# EAGLE design DSPIC33_Board_DIP_2020_09_23_A (EAGLE 9.6.1)
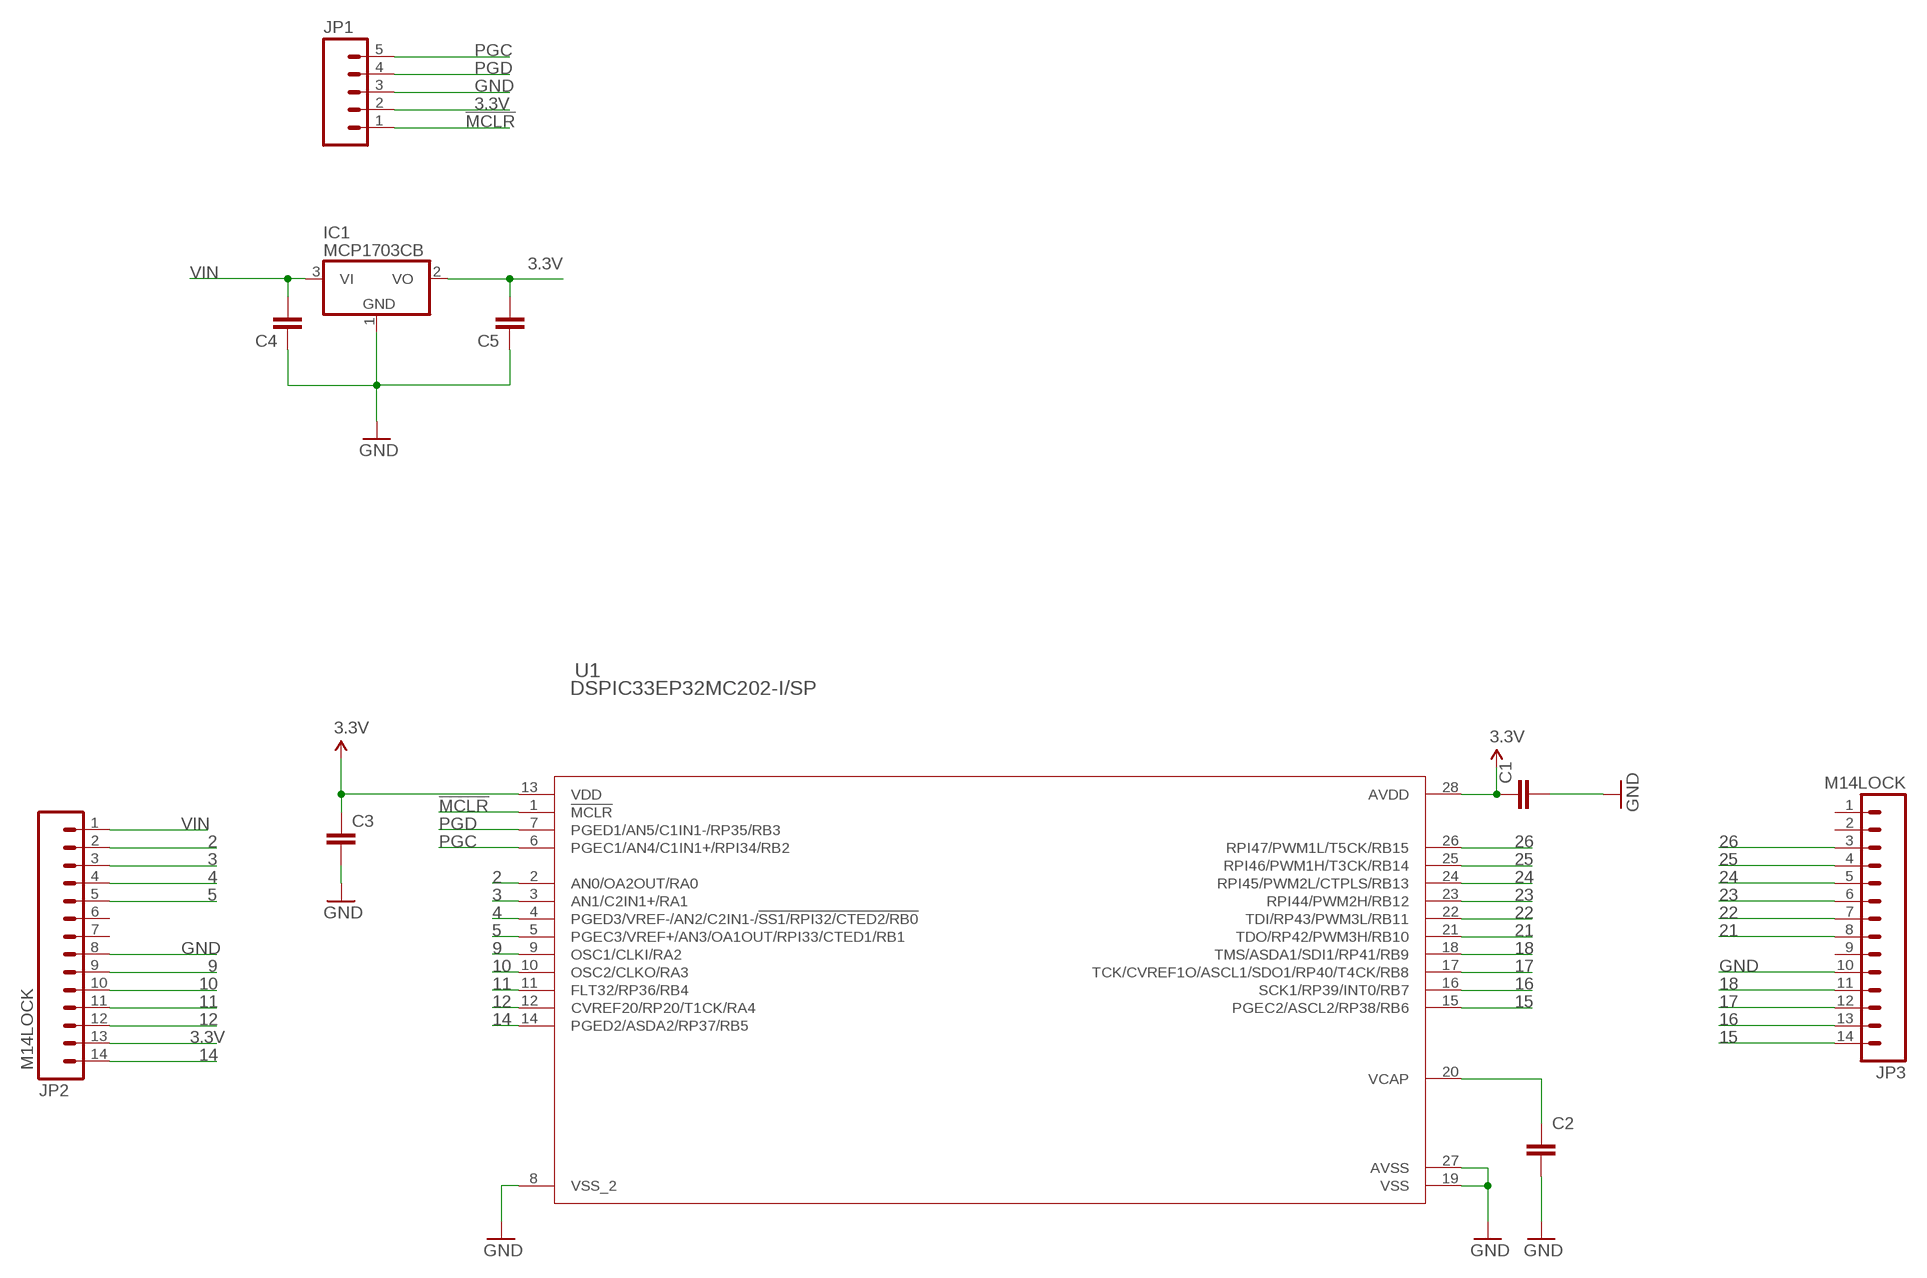
[diagram p0: schematic, sheet 1]

## Parts
C1  CAP1206  [1206]
C2  CAP1206  [1206]
C3  CAP1206  [1206]
C4  CAP1206  [1206]
C5  CAP1206  [1206]
IC1  MCP1703CB  [SOT23]
JP1  M05LOCK  [1X05_LOCK]
JP2  M14LOCK  [1X14_LOCK]
JP3  M14LOCK  [1X14_LOCK]
U1  DSPIC33EP32MC202-I/SP  [SPDIP28_300MC_MCH]

## Nets
2: JP2.2 U1.2(AN0/OA2OUT/RA0)
3: JP2.3 U1.3(AN1/C2IN1+/RA1)
3.3V: C1.1 C3.1 C5.2 IC1.2(VO) JP1.2 JP2.13 U1.13(VDD) U1.28(AVDD)
4: JP2.4 U1.4(PGED3/VREF-/AN2/C2IN1-/!SS1/RPI32/CTED2/RB0)
5: JP2.5 U1.5(PGEC3/VREF+/AN3/OA1OUT/RPI33/CTED1/RB1)
9: JP2.9 U1.9(OSC1/CLKI/RA2)
10: JP2.10 U1.10(OSC2/CLKO/RA3)
11: JP2.11 U1.11(FLT32/RP36/RB4)
12: JP2.12 U1.12(CVREF20/RP20/T1CK/RA4)
14: JP2.14 U1.14(PGED2/ASDA2/RP37/RB5)
15: JP3.14 U1.15(PGEC2/ASCL2/RP38/RB6)
16: JP3.13 U1.16(SCK1/RP39/INT0/RB7)
17: JP3.12 U1.17(TCK/CVREF1O/ASCL1/SDO1/RP40/T4CK/RB8)
18: JP3.11 U1.18(TMS/ASDA1/SDI1/RP41/RB9)
21: JP3.8 U1.21(TDO/RP42/PWM3H/RB10)
22: JP3.7 U1.22(TDI/RP43/PWM3L/RB11)
23: JP3.6 U1.23(RPI44/PWM2H/RB12)
24: JP3.5 U1.24(RPI45/PWM2L/CTPLS/RB13)
25: JP3.4 U1.25(RPI46/PWM1H/T3CK/RB14)
26: JP3.3 U1.26(RPI47/PWM1L/T5CK/RB15)
!MCLR: JP1.1 U1.1(!MCLR)
GND: C1.2 C2.1 C3.2 C4.1 C5.1 IC1.1(GND) JP1.3 JP2.8 JP3.10 U1.8(VSS_2) U1.19(VSS) U1.27(AVSS)
N$1: C2.2 U1.20(VCAP)
PGC: JP1.5 U1.6(PGEC1/AN4/C1IN1+/RPI34/RB2)
PGD: JP1.4 U1.7(PGED1/AN5/C1IN1-/RP35/RB3)
VIN: C4.2 IC1.3(VI) JP2.1
Unconnected: JP2.6 JP2.7 JP3.1 JP3.2 JP3.9

## Library data of the parts
C1-C5 = SparkFun-Passives:CAP: Capacitor Standard 0603 ceramic capacitor, and 0.1" leaded capacitor.
IC1 = linear:MCP1703: 250 mA, 16V, Low Quiescent Current LDO Regulator Source: http://ww1.microchip.com/downloads/en/DeviceDoc/22049b.pdf
JP1 = SparkFun-Connectors:M05: Header 5 Standard 5-pin 0.1" header. Use with straight break away headers (SKU : PRT-00116), right angle break away headers (PRT-00553), swiss pins (PRT-00743), machine pins (PRT-00117), and female headers (PRT-00115). Molex polarized connector foot print use with SKU : PRT-08230 with associated crimp pins and housings.
JP2 JP3 = SparkFun-Connectors:M14: Header 14 Standard 14-pin 0.1" header. Use with straight break away headers (SKU : PRT-00116), right angle break away headers (PRT-00553), swiss pins (PRT-00743), machine pins (PRT-00117), and female headers (PRT-00115).
U1 = DSPIC33EP32MC202-DIP:DSPIC33EP32MC202-I/SP; BUILT_BY: EMA_Jessica; COPYRIGHT: Copyright (C) 2018 Accelerated Designs. All rights reserved; MANUFACTURER_PART_NUMBER: DSPIC33EP32MC202-I/SP; SOURCELIBRARY: Microchip_2019-08-23_20; VENDOR: Microchip

## Board
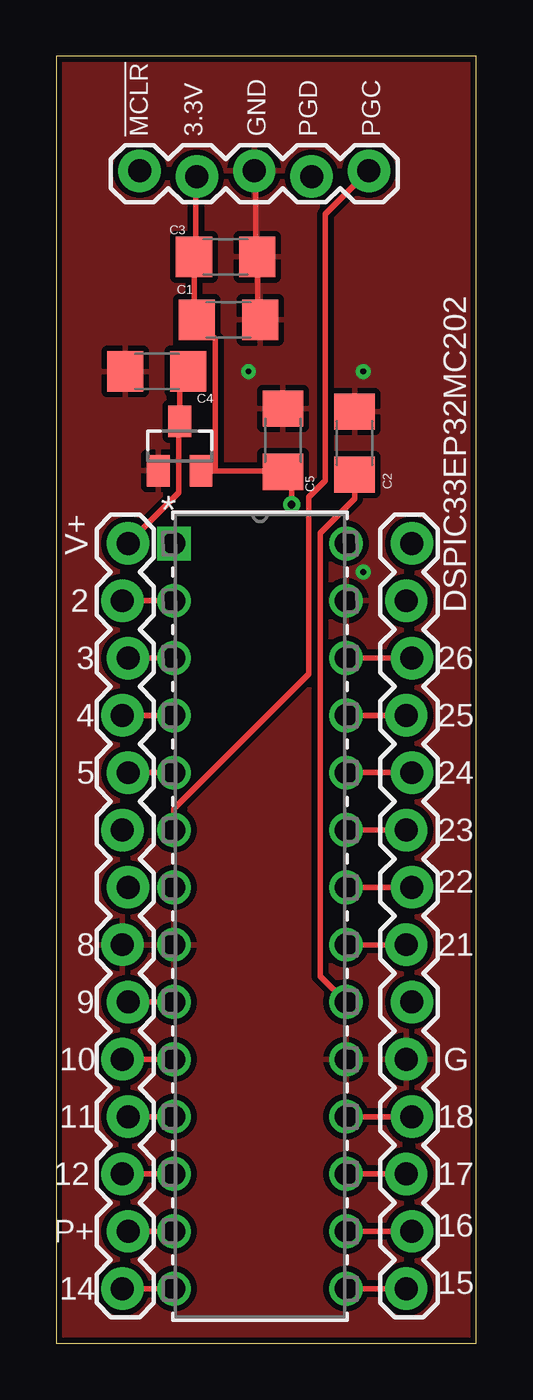
[diagram p1: board, top side]
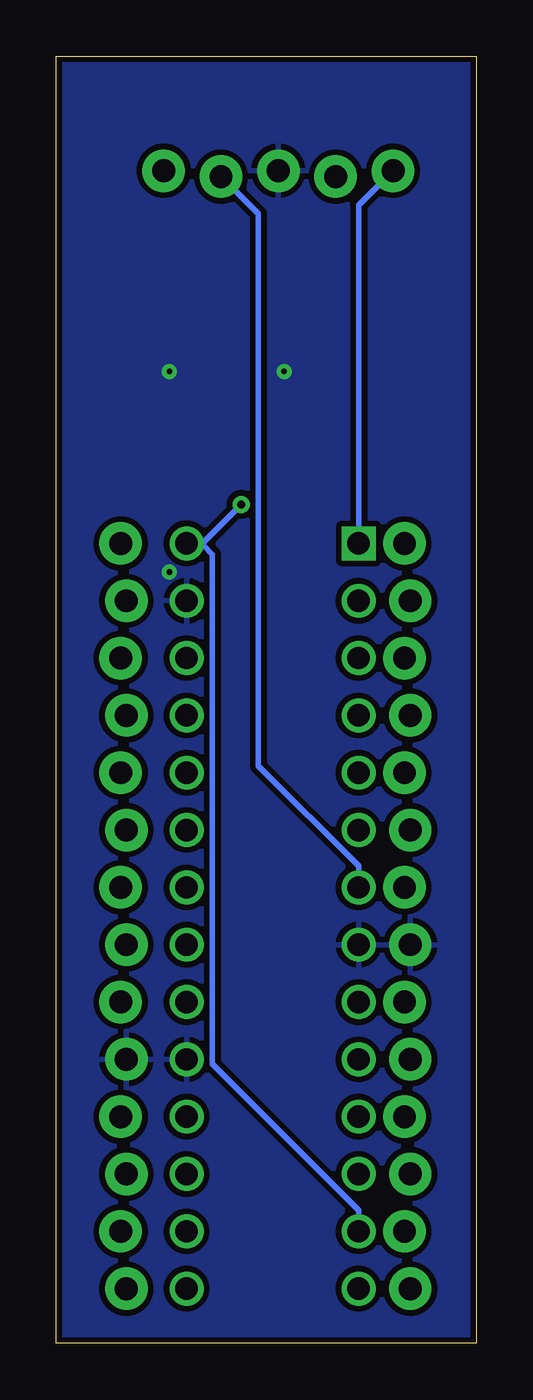
[diagram p2: board, bottom side, seen from below]

Size 18.59 x 57.01 mm. Coordinates in mm from the lower left corner, seen from the top.
Outline: 0,0 18.59,0 18.59,57.01 0,57.01 0,0
Copper layers (1*16): Top 0.035mm / dielectric 1.5mm / Bottom 0.035mm
Design rules "default": minimum track width 10mil, minimum drill 0.35mm, track to track 10mil, track to pad 10mil, pad to pad 10mil, via to via 10mil, smd to smd 6mil, copper to edge 10mil, drill to drill 6mil, minimum pad ring 10mil, minimum via ring 8mil, stop-mask expansion 4mil, vias tented up to drill 0mil, thermal gap 10mil

### Footprints (pad centres in the part's own frame; a part is rotated, then mirrored left to right if it is on the bottom)
1206 = smd 1.6 x 1.8: 1 -1.4,0; 2 1.4,0
SOT23 = smd 1 x 1.4: 1 -0.95,-1.1; 2 0.95,-1.1; 3 0,1.1
1X05_LOCK = drill 1.016 pad 1.88: 1 0,0.127; 2 2.54,-0.127; 3 5.08,0.127; 4 7.62,-0.127; 5 10.16,0.127
1X14_LOCK = drill 1.016 pad 1.88: 1 0,0.127; 2 2.54,-0.127; 3 5.08,0.127; 4 7.62,-0.127; 5 10.16,0.127; 6 12.7,-0.127; 7 15.24,0.127; 8 17.78,-0.127; 9 20.32,0.127; 10 22.86,-0.127; 11 25.4,0.127; 12 27.94,-0.127; 13 30.48,0.127; 14 33.02,-0.127
SPDIP28_300MC_MCH = drill 0.991 pad 1.499 square: 1 0,0 | drill 0.991 pad 1.499: 2 0,-2.54; 3 0,-5.08; 4 0,-7.62; 5 0,-10.16; 6 0,-12.7; 7 0,-15.24; 8 0,-17.78; 9 0,-20.32; 10 0,-22.86; 11 0,-25.4; 12 0,-27.94; 13 0,-30.48; 14 0,-33.02; 15 7.62,-33.02; 16 7.62,-30.48; 17 7.62,-27.94; 18 7.62,-25.4; 19 7.62,-22.86; 20 7.62,-20.32; 21 7.62,-17.78; 22 7.62,-15.24; 23 7.62,-12.7; 24 7.62,-10.16; 25 7.62,-7.62; 26 7.62,-5.08; 27 7.62,-2.54; 28 7.62,0

### Placement (x,y rotation side)
C1  7.62,45.34 0 top
C2  13.21,39.88 270 top
C3  7.49,48.13 0 top
C4  4.45,43.05 0 top
C5  10.03,40.01 270 top
IC1  5.46,39.75 0 top
JP1  3.68,51.82 0 top
JP2  3.05,35.43 270 top
JP3  15.62,35.43 270 top
U1  5.21,35.43 0 top

### Tracks (layer width: path | path; a pad name or v marks a point on that pad's centre or on a via)
2
  Top 0.254: JP2.2 U1.2
3
  Top 0.254: JP2.3 U1.3
3.3V  (via drill 0.35)
  Top 0.254: JP2.13 U1.13 | 7.04,38.63 10.01,38.63 C5.2 10.08,38.48 10.41,38.15 v10.41,37.16 | 7.04,38.63 6.43,38.63 IC1.2 | JP1.2 6.17,51.64 6.17,48.23 C3.1 6.1,45.44 6.2,45.34 C1.1 6.27,45.24 7.04,44.48 7.04,38.63
  Bottom 0.254: 12.14,35.43 U1.28 | v10.41,37.16 12.14,35.43 | U1.13 5.21,5.89 11.68,12.37 11.68,34.95 12.07,35.33 12.14,35.43
4
  Top 0.254: JP2.4 U1.4
5
  Top 0.254: JP2.5 U1.5
9
  Top 0.254: JP2.9 U1.9
10
  Top 0.254: JP2.10 U1.10
11
  Top 0.254: JP2.11 U1.11
12
  Top 0.254: JP2.12 U1.12
14
  Top 0.254: JP2.14 U1.14
15
  Top 0.254: JP3.14 U1.15
16
  Top 0.254: JP3.13 U1.16
17
  Top 0.254: JP3.12 U1.17
18
  Top 0.254: JP3.11 U1.18
21
  Top 0.254: JP3.8 U1.21
22
  Top 0.254: JP3.7 U1.22
23
  Top 0.254: JP3.6 U1.23
24
  Top 0.254: JP3.5 U1.24
25
  Top 0.254: JP3.4 U1.25
26
  Top 0.254: JP3.3 U1.26
!MCLR
  Bottom 0.254: U1.1 5.21,50.42 JP1.1
GND  (via drill 0.25)
  Top 0.254: C1.2 8.92,45.44 8.92,48.13 C3.2 8.84,48.23 8.84,51.87 JP1.3
  other vias: 8.51,43.05 13.59,43.05 13.59,34.16
  pour Top (isolate 0.254): -2.67,57.28 20.19,57.28 20.19,0.38 19.43,-0.38 -1.9,-0.38 -2.67,0.38
  pour Bottom (isolate 0.254): -2.16,59.31 20.7,59.31 23.5,56.52 23.5,0.13 15.62,-7.75 3.68,-7.75 -6.98,2.92 -6.98,54.48
N$1
  Top 0.254: C2.2 13.21,37.41 11.68,35.89 11.68,16.26 U1.20
PGC
  Top 0.254: U1.6 5.21,23.67 11.18,29.64 11.18,37.49 11.91,38.23 11.91,50.01 JP1.5
PGD
  Bottom 0.254: U1.7 5.21,21.13 9.65,25.58 9.65,50.04 JP1.4
VIN
  Top 0.254: C4.2 5.46,42.67 IC1.3 5.41,40.74 5.41,37.69 3.18,35.46 JP2.1

### Text on the board
tPlace: !MCLR | 3.3V | GND | PGD | PGC | V+ | 2 | DSPIC33EP32MC202 | 3 | 26 | 4 | 25 | 5 | 24 | 23 | 22 | 8 | 21 | 9 | 10 | G | 11 | 18 | 12 | 17 | 16 | P+ | 14 | 15